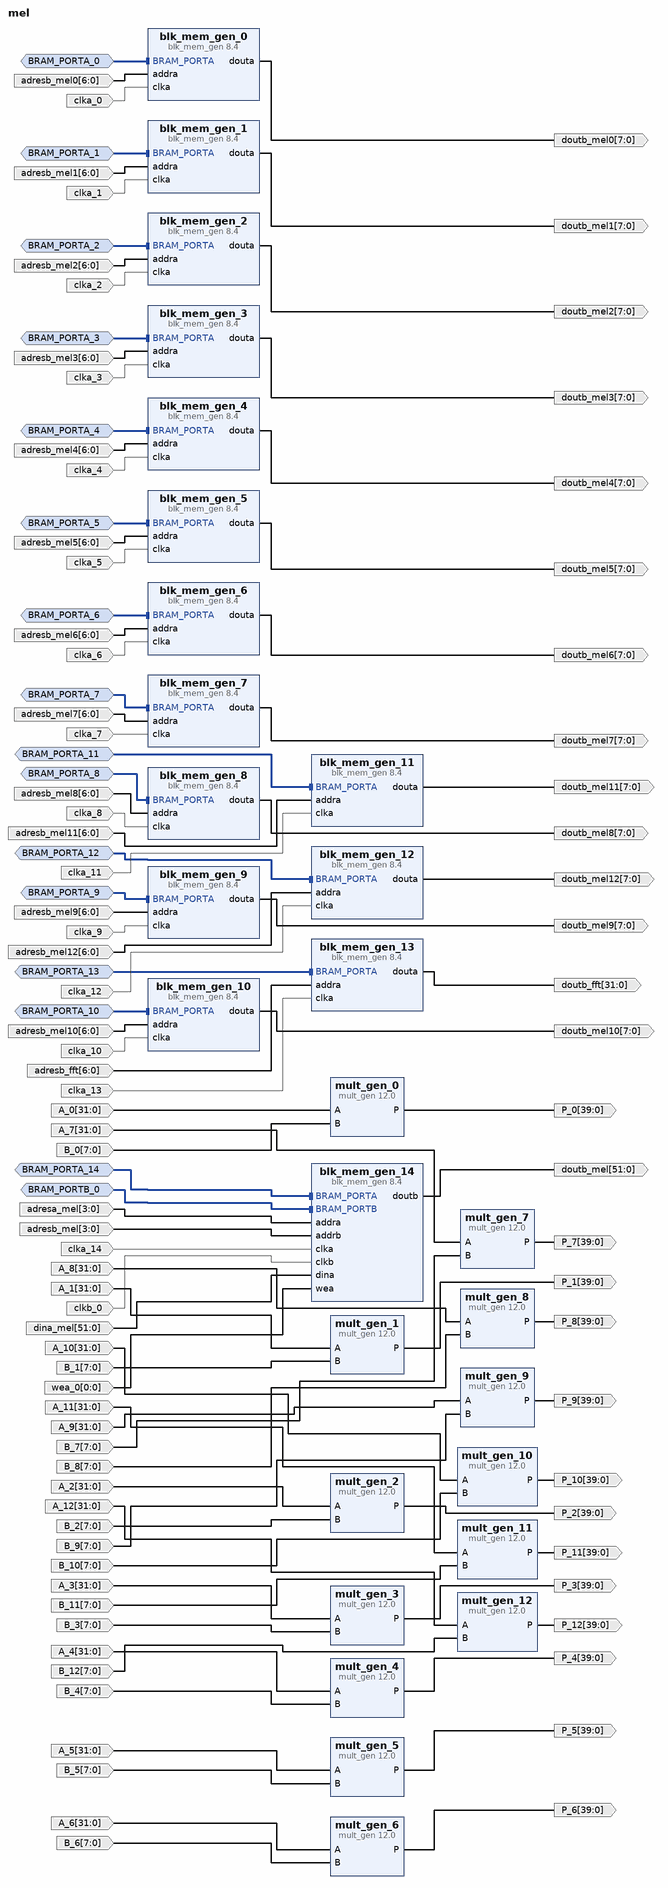
[diagram p0: block diagram of the top level]
# Vivado block design mel, xc7a35tcpg236-1, Vivado 2022.1
create_bd_design mel

create_bd_intf_port -mode Slave -vlnv xilinx.com:interface:bram_rtl:1.0 BRAM_PORTA_0
create_bd_intf_port -mode Slave -vlnv xilinx.com:interface:bram_rtl:1.0 BRAM_PORTA_1
create_bd_intf_port -mode Slave -vlnv xilinx.com:interface:bram_rtl:1.0 BRAM_PORTA_2
create_bd_intf_port -mode Slave -vlnv xilinx.com:interface:bram_rtl:1.0 BRAM_PORTA_3
create_bd_intf_port -mode Slave -vlnv xilinx.com:interface:bram_rtl:1.0 BRAM_PORTA_4
create_bd_intf_port -mode Slave -vlnv xilinx.com:interface:bram_rtl:1.0 BRAM_PORTA_5
create_bd_intf_port -mode Slave -vlnv xilinx.com:interface:bram_rtl:1.0 BRAM_PORTA_6
create_bd_intf_port -mode Slave -vlnv xilinx.com:interface:bram_rtl:1.0 BRAM_PORTA_7
create_bd_intf_port -mode Slave -vlnv xilinx.com:interface:bram_rtl:1.0 BRAM_PORTA_8
create_bd_intf_port -mode Slave -vlnv xilinx.com:interface:bram_rtl:1.0 BRAM_PORTA_9
create_bd_intf_port -mode Slave -vlnv xilinx.com:interface:bram_rtl:1.0 BRAM_PORTA_10
create_bd_intf_port -mode Slave -vlnv xilinx.com:interface:bram_rtl:1.0 BRAM_PORTA_11
create_bd_intf_port -mode Slave -vlnv xilinx.com:interface:bram_rtl:1.0 BRAM_PORTA_12
create_bd_intf_port -mode Slave -vlnv xilinx.com:interface:bram_rtl:1.0 BRAM_PORTA_13
create_bd_intf_port -mode Slave -vlnv xilinx.com:interface:bram_rtl:1.0 BRAM_PORTA_14
create_bd_intf_port -mode Slave -vlnv xilinx.com:interface:bram_rtl:1.0 BRAM_PORTB_0
create_bd_port -dir I -from 31 -to 0 -type data A_0
create_bd_port -dir I -from 7 -to 0 -type data B_0
create_bd_port -dir O -from 39 -to 0 -type data P_0
create_bd_port -dir I -from 31 -to 0 -type data A_1
create_bd_port -dir I -from 7 -to 0 -type data B_1
create_bd_port -dir O -from 39 -to 0 -type data P_1
create_bd_port -dir I -from 31 -to 0 -type data A_2
create_bd_port -dir I -from 7 -to 0 -type data B_2
create_bd_port -dir O -from 39 -to 0 -type data P_2
create_bd_port -dir I -from 31 -to 0 -type data A_3
create_bd_port -dir I -from 7 -to 0 -type data B_3
create_bd_port -dir O -from 39 -to 0 -type data P_3
create_bd_port -dir I -from 31 -to 0 -type data A_4
create_bd_port -dir I -from 7 -to 0 -type data B_4
create_bd_port -dir O -from 39 -to 0 -type data P_4
create_bd_port -dir I -from 31 -to 0 -type data A_5
create_bd_port -dir I -from 7 -to 0 -type data B_5
create_bd_port -dir O -from 39 -to 0 -type data P_5
create_bd_port -dir I -from 31 -to 0 -type data A_6
create_bd_port -dir I -from 7 -to 0 -type data B_6
create_bd_port -dir O -from 39 -to 0 -type data P_6
create_bd_port -dir I -from 31 -to 0 -type data A_7
create_bd_port -dir I -from 7 -to 0 -type data B_7
create_bd_port -dir O -from 39 -to 0 -type data P_7
create_bd_port -dir I -from 31 -to 0 -type data A_8
create_bd_port -dir I -from 7 -to 0 -type data B_8
create_bd_port -dir O -from 39 -to 0 -type data P_8
create_bd_port -dir I -from 31 -to 0 -type data A_9
create_bd_port -dir I -from 7 -to 0 -type data B_9
create_bd_port -dir O -from 39 -to 0 -type data P_9
create_bd_port -dir I -from 31 -to 0 -type data A_10
create_bd_port -dir I -from 7 -to 0 -type data B_10
create_bd_port -dir O -from 39 -to 0 -type data P_10
create_bd_port -dir I -from 31 -to 0 -type data A_11
create_bd_port -dir I -from 7 -to 0 -type data B_11
create_bd_port -dir O -from 39 -to 0 -type data P_11
create_bd_port -dir I -from 31 -to 0 -type data A_12
create_bd_port -dir I -from 7 -to 0 -type data B_12
create_bd_port -dir O -from 39 -to 0 -type data P_12
create_bd_port -dir I -from 6 -to 0 adresb_mel0
create_bd_port -dir I -type clk clka_0
create_bd_port -dir O -from 7 -to 0 doutb_mel0
create_bd_port -dir I -from 6 -to 0 adresb_mel1
create_bd_port -dir I -type clk clka_1
create_bd_port -dir O -from 7 -to 0 doutb_mel1
create_bd_port -dir I -from 6 -to 0 adresb_mel2
create_bd_port -dir I -type clk clka_2
create_bd_port -dir O -from 7 -to 0 doutb_mel2
create_bd_port -dir I -from 6 -to 0 adresb_mel3
create_bd_port -dir I -type clk clka_3
create_bd_port -dir O -from 7 -to 0 doutb_mel3
create_bd_port -dir I -from 6 -to 0 adresb_mel4
create_bd_port -dir I -type clk clka_4
create_bd_port -dir O -from 7 -to 0 doutb_mel4
create_bd_port -dir I -from 6 -to 0 adresb_mel5
create_bd_port -dir I -type clk clka_5
create_bd_port -dir O -from 7 -to 0 doutb_mel5
create_bd_port -dir I -from 6 -to 0 adresb_mel6
create_bd_port -dir I -type clk clka_6
create_bd_port -dir O -from 7 -to 0 doutb_mel6
create_bd_port -dir I -from 6 -to 0 adresb_mel7
create_bd_port -dir I -type clk clka_7
create_bd_port -dir O -from 7 -to 0 doutb_mel7
create_bd_port -dir I -from 6 -to 0 adresb_mel8
create_bd_port -dir I -type clk clka_8
create_bd_port -dir O -from 7 -to 0 doutb_mel8
create_bd_port -dir I -from 6 -to 0 adresb_mel9
create_bd_port -dir I -type clk clka_9
create_bd_port -dir O -from 7 -to 0 doutb_mel9
create_bd_port -dir I -from 6 -to 0 adresb_mel10
create_bd_port -dir I -type clk clka_10
create_bd_port -dir O -from 7 -to 0 doutb_mel10
create_bd_port -dir I -from 6 -to 0 adresb_mel11
create_bd_port -dir I -type clk clka_11
create_bd_port -dir O -from 7 -to 0 doutb_mel11
create_bd_port -dir I -from 6 -to 0 adresb_mel12
create_bd_port -dir I -type clk clka_12
create_bd_port -dir O -from 7 -to 0 doutb_mel12
create_bd_port -dir I -from 6 -to 0 adresb_fft
create_bd_port -dir I -type clk clka_13
create_bd_port -dir O -from 31 -to 0 doutb_fft
create_bd_port -dir I -from 3 -to 0 adresa_mel
create_bd_port -dir I -type clk clka_14
create_bd_port -dir I -from 51 -to 0 dina_mel
create_bd_port -dir I -from 0 -to 0 wea_0
create_bd_port -dir I -from 3 -to 0 adresb_mel
create_bd_port -dir I -type clk clkb_0
create_bd_port -dir O -from 51 -to 0 doutb_mel

create_bd_cell -type ip -vlnv xilinx.com:ip:blk_mem_gen:8.4 blk_mem_gen_0
set_property -dict [list \
  CONFIG.Coe_File {../../../../../../../mel coeler/mel_1.coe} \
  CONFIG.Enable_32bit_Address false \
  CONFIG.Enable_A Always_Enabled \
  CONFIG.Load_Init_File true \
  CONFIG.Memory_Type Single_Port_ROM \
  CONFIG.Port_A_Write_Rate 0 \
  CONFIG.Register_PortA_Output_of_Memory_Primitives true \
  CONFIG.Use_RSTA_Pin false \
  CONFIG.Write_Depth_A 128 \
  CONFIG.Write_Width_A 8 \
  CONFIG.use_bram_block Stand_Alone \
] [get_bd_cells blk_mem_gen_0]
create_bd_cell -type ip -vlnv xilinx.com:ip:blk_mem_gen:8.4 blk_mem_gen_1
set_property -dict [list \
  CONFIG.Coe_File {../../../../../../../mel coeler/mel_2.coe} \
  CONFIG.Enable_32bit_Address false \
  CONFIG.Enable_A Always_Enabled \
  CONFIG.Load_Init_File true \
  CONFIG.Memory_Type Single_Port_ROM \
  CONFIG.Port_A_Write_Rate 0 \
  CONFIG.Register_PortA_Output_of_Memory_Primitives true \
  CONFIG.Use_RSTA_Pin false \
  CONFIG.Write_Depth_A 128 \
  CONFIG.Write_Width_A 8 \
  CONFIG.use_bram_block Stand_Alone \
] [get_bd_cells blk_mem_gen_1]
create_bd_cell -type ip -vlnv xilinx.com:ip:blk_mem_gen:8.4 blk_mem_gen_2
set_property -dict [list \
  CONFIG.Coe_File {../../../../../../../mel coeler/mel_3.coe} \
  CONFIG.Enable_32bit_Address false \
  CONFIG.Enable_A Always_Enabled \
  CONFIG.Load_Init_File true \
  CONFIG.Memory_Type Single_Port_ROM \
  CONFIG.Port_A_Write_Rate 0 \
  CONFIG.Register_PortA_Output_of_Memory_Primitives true \
  CONFIG.Use_RSTA_Pin false \
  CONFIG.Write_Depth_A 128 \
  CONFIG.Write_Width_A 8 \
  CONFIG.use_bram_block Stand_Alone \
] [get_bd_cells blk_mem_gen_2]
create_bd_cell -type ip -vlnv xilinx.com:ip:blk_mem_gen:8.4 blk_mem_gen_3
set_property -dict [list \
  CONFIG.Coe_File {../../../../../../../mel coeler/mel_4.coe} \
  CONFIG.Enable_32bit_Address false \
  CONFIG.Enable_A Always_Enabled \
  CONFIG.Load_Init_File true \
  CONFIG.Memory_Type Single_Port_ROM \
  CONFIG.Port_A_Write_Rate 0 \
  CONFIG.Register_PortA_Output_of_Memory_Primitives true \
  CONFIG.Use_RSTA_Pin false \
  CONFIG.Write_Depth_A 128 \
  CONFIG.Write_Width_A 8 \
  CONFIG.use_bram_block Stand_Alone \
] [get_bd_cells blk_mem_gen_3]
create_bd_cell -type ip -vlnv xilinx.com:ip:blk_mem_gen:8.4 blk_mem_gen_4
set_property -dict [list \
  CONFIG.Coe_File {../../../../../../../mel coeler/mel_5.coe} \
  CONFIG.Enable_32bit_Address false \
  CONFIG.Enable_A Always_Enabled \
  CONFIG.Load_Init_File true \
  CONFIG.Memory_Type Single_Port_ROM \
  CONFIG.Port_A_Write_Rate 0 \
  CONFIG.Register_PortA_Output_of_Memory_Primitives true \
  CONFIG.Use_RSTA_Pin false \
  CONFIG.Write_Depth_A 128 \
  CONFIG.Write_Width_A 8 \
  CONFIG.use_bram_block Stand_Alone \
] [get_bd_cells blk_mem_gen_4]
create_bd_cell -type ip -vlnv xilinx.com:ip:blk_mem_gen:8.4 blk_mem_gen_5
set_property -dict [list \
  CONFIG.Coe_File {../../../../../../../mel coeler/mel_6.coe} \
  CONFIG.Enable_32bit_Address false \
  CONFIG.Enable_A Always_Enabled \
  CONFIG.Load_Init_File true \
  CONFIG.Memory_Type Single_Port_ROM \
  CONFIG.Port_A_Write_Rate 0 \
  CONFIG.Register_PortA_Output_of_Memory_Primitives true \
  CONFIG.Use_RSTA_Pin false \
  CONFIG.Write_Depth_A 128 \
  CONFIG.Write_Width_A 8 \
  CONFIG.use_bram_block Stand_Alone \
] [get_bd_cells blk_mem_gen_5]
create_bd_cell -type ip -vlnv xilinx.com:ip:blk_mem_gen:8.4 blk_mem_gen_6
set_property -dict [list \
  CONFIG.Coe_File {../../../../../../../mel coeler/mel_7.coe} \
  CONFIG.Enable_32bit_Address false \
  CONFIG.Enable_A Always_Enabled \
  CONFIG.Load_Init_File true \
  CONFIG.Memory_Type Single_Port_ROM \
  CONFIG.Port_A_Write_Rate 0 \
  CONFIG.Register_PortA_Output_of_Memory_Primitives true \
  CONFIG.Use_RSTA_Pin false \
  CONFIG.Write_Depth_A 128 \
  CONFIG.Write_Width_A 8 \
  CONFIG.use_bram_block Stand_Alone \
] [get_bd_cells blk_mem_gen_6]
create_bd_cell -type ip -vlnv xilinx.com:ip:blk_mem_gen:8.4 blk_mem_gen_7
set_property -dict [list \
  CONFIG.Coe_File {../../../../../../../mel coeler/mel_8.coe} \
  CONFIG.Enable_32bit_Address false \
  CONFIG.Enable_A Always_Enabled \
  CONFIG.Load_Init_File true \
  CONFIG.Memory_Type Single_Port_ROM \
  CONFIG.Port_A_Write_Rate 0 \
  CONFIG.Register_PortA_Output_of_Memory_Primitives true \
  CONFIG.Use_RSTA_Pin false \
  CONFIG.Write_Depth_A 128 \
  CONFIG.Write_Width_A 8 \
  CONFIG.use_bram_block Stand_Alone \
] [get_bd_cells blk_mem_gen_7]
create_bd_cell -type ip -vlnv xilinx.com:ip:blk_mem_gen:8.4 blk_mem_gen_8
set_property -dict [list \
  CONFIG.Coe_File {../../../../../../../mel coeler/mel_9.coe} \
  CONFIG.Enable_32bit_Address false \
  CONFIG.Enable_A Always_Enabled \
  CONFIG.Load_Init_File true \
  CONFIG.Memory_Type Single_Port_ROM \
  CONFIG.Port_A_Write_Rate 0 \
  CONFIG.Register_PortA_Output_of_Memory_Primitives true \
  CONFIG.Use_RSTA_Pin false \
  CONFIG.Write_Depth_A 128 \
  CONFIG.Write_Width_A 8 \
  CONFIG.use_bram_block Stand_Alone \
] [get_bd_cells blk_mem_gen_8]
create_bd_cell -type ip -vlnv xilinx.com:ip:blk_mem_gen:8.4 blk_mem_gen_9
set_property -dict [list \
  CONFIG.Coe_File {../../../../../../../mel coeler/mel_10.coe} \
  CONFIG.Enable_32bit_Address false \
  CONFIG.Enable_A Always_Enabled \
  CONFIG.Load_Init_File true \
  CONFIG.Memory_Type Single_Port_ROM \
  CONFIG.Port_A_Write_Rate 0 \
  CONFIG.Register_PortA_Output_of_Memory_Primitives true \
  CONFIG.Use_RSTA_Pin false \
  CONFIG.Write_Depth_A 128 \
  CONFIG.Write_Width_A 8 \
  CONFIG.use_bram_block Stand_Alone \
] [get_bd_cells blk_mem_gen_9]
create_bd_cell -type ip -vlnv xilinx.com:ip:blk_mem_gen:8.4 blk_mem_gen_10
set_property -dict [list \
  CONFIG.Coe_File {../../../../../../../mel coeler/mel_11.coe} \
  CONFIG.Enable_32bit_Address false \
  CONFIG.Enable_A Always_Enabled \
  CONFIG.Load_Init_File true \
  CONFIG.Memory_Type Single_Port_ROM \
  CONFIG.Port_A_Write_Rate 0 \
  CONFIG.Register_PortA_Output_of_Memory_Primitives true \
  CONFIG.Use_RSTA_Pin false \
  CONFIG.Write_Depth_A 128 \
  CONFIG.Write_Width_A 8 \
  CONFIG.use_bram_block Stand_Alone \
] [get_bd_cells blk_mem_gen_10]
create_bd_cell -type ip -vlnv xilinx.com:ip:blk_mem_gen:8.4 blk_mem_gen_11
set_property -dict [list \
  CONFIG.Coe_File {../../../../../../../mel coeler/mel_12.coe} \
  CONFIG.Enable_32bit_Address false \
  CONFIG.Enable_A Always_Enabled \
  CONFIG.Load_Init_File true \
  CONFIG.Memory_Type Single_Port_ROM \
  CONFIG.Port_A_Write_Rate 0 \
  CONFIG.Register_PortA_Output_of_Memory_Primitives true \
  CONFIG.Use_RSTA_Pin false \
  CONFIG.Write_Depth_A 128 \
  CONFIG.Write_Width_A 8 \
  CONFIG.use_bram_block Stand_Alone \
] [get_bd_cells blk_mem_gen_11]
create_bd_cell -type ip -vlnv xilinx.com:ip:blk_mem_gen:8.4 blk_mem_gen_12
set_property -dict [list \
  CONFIG.Coe_File {../../../../../../../mel coeler/mel_13.coe} \
  CONFIG.Enable_32bit_Address false \
  CONFIG.Enable_A Always_Enabled \
  CONFIG.Load_Init_File true \
  CONFIG.Memory_Type Single_Port_ROM \
  CONFIG.Port_A_Write_Rate 0 \
  CONFIG.Register_PortA_Output_of_Memory_Primitives true \
  CONFIG.Use_RSTA_Pin false \
  CONFIG.Write_Depth_A 128 \
  CONFIG.Write_Width_A 8 \
  CONFIG.use_bram_block Stand_Alone \
] [get_bd_cells blk_mem_gen_12]
create_bd_cell -type ip -vlnv xilinx.com:ip:blk_mem_gen:8.4 blk_mem_gen_13
set_property -dict [list \
  CONFIG.Coe_File {../../../../../../../mel coeler/arda_coe.coe} \
  CONFIG.Enable_32bit_Address false \
  CONFIG.Enable_A Always_Enabled \
  CONFIG.Load_Init_File true \
  CONFIG.Memory_Type Single_Port_ROM \
  CONFIG.Port_A_Write_Rate 0 \
  CONFIG.Register_PortA_Output_of_Memory_Primitives true \
  CONFIG.Use_RSTA_Pin false \
  CONFIG.Write_Depth_A 128 \
  CONFIG.use_bram_block Stand_Alone \
] [get_bd_cells blk_mem_gen_13]
create_bd_cell -type ip -vlnv xilinx.com:ip:blk_mem_gen:8.4 blk_mem_gen_14
set_property -dict [list \
  CONFIG.Enable_32bit_Address false \
  CONFIG.Enable_A Always_Enabled \
  CONFIG.Enable_B Always_Enabled \
  CONFIG.Memory_Type Simple_Dual_Port_RAM \
  CONFIG.Operating_Mode_A NO_CHANGE \
  CONFIG.Port_B_Clock 100 \
  CONFIG.Port_B_Enable_Rate 100 \
  CONFIG.Read_Width_B 52 \
  CONFIG.Register_PortB_Output_of_Memory_Primitives true \
  CONFIG.Use_Byte_Write_Enable false \
  CONFIG.Write_Depth_A 13 \
  CONFIG.Write_Width_A 52 \
  CONFIG.Write_Width_B 52 \
  CONFIG.use_bram_block Stand_Alone \
] [get_bd_cells blk_mem_gen_14]
create_bd_cell -type ip -vlnv xilinx.com:ip:mult_gen:12.0 mult_gen_0
set_property -dict [list \
  CONFIG.Multiplier_Construction Use_Mults \
  CONFIG.PipeStages 0 \
  CONFIG.PortAType Unsigned \
  CONFIG.PortAWidth 32 \
  CONFIG.PortBType Unsigned \
  CONFIG.PortBWidth 8 \
] [get_bd_cells mult_gen_0]
create_bd_cell -type ip -vlnv xilinx.com:ip:mult_gen:12.0 mult_gen_1
set_property -dict [list \
  CONFIG.Multiplier_Construction Use_Mults \
  CONFIG.PipeStages 0 \
  CONFIG.PortAType Unsigned \
  CONFIG.PortAWidth 32 \
  CONFIG.PortBType Unsigned \
  CONFIG.PortBWidth 8 \
] [get_bd_cells mult_gen_1]
create_bd_cell -type ip -vlnv xilinx.com:ip:mult_gen:12.0 mult_gen_2
set_property -dict [list \
  CONFIG.Multiplier_Construction Use_Mults \
  CONFIG.PipeStages 0 \
  CONFIG.PortAType Unsigned \
  CONFIG.PortAWidth 32 \
  CONFIG.PortBType Unsigned \
  CONFIG.PortBWidth 8 \
] [get_bd_cells mult_gen_2]
create_bd_cell -type ip -vlnv xilinx.com:ip:mult_gen:12.0 mult_gen_3
set_property -dict [list \
  CONFIG.Multiplier_Construction Use_Mults \
  CONFIG.PipeStages 0 \
  CONFIG.PortAType Unsigned \
  CONFIG.PortAWidth 32 \
  CONFIG.PortBType Unsigned \
  CONFIG.PortBWidth 8 \
] [get_bd_cells mult_gen_3]
create_bd_cell -type ip -vlnv xilinx.com:ip:mult_gen:12.0 mult_gen_4
set_property -dict [list \
  CONFIG.Multiplier_Construction Use_Mults \
  CONFIG.PipeStages 0 \
  CONFIG.PortAType Unsigned \
  CONFIG.PortAWidth 32 \
  CONFIG.PortBType Unsigned \
  CONFIG.PortBWidth 8 \
] [get_bd_cells mult_gen_4]
create_bd_cell -type ip -vlnv xilinx.com:ip:mult_gen:12.0 mult_gen_5
set_property -dict [list \
  CONFIG.Multiplier_Construction Use_Mults \
  CONFIG.PipeStages 0 \
  CONFIG.PortAType Unsigned \
  CONFIG.PortAWidth 32 \
  CONFIG.PortBType Unsigned \
  CONFIG.PortBWidth 8 \
] [get_bd_cells mult_gen_5]
create_bd_cell -type ip -vlnv xilinx.com:ip:mult_gen:12.0 mult_gen_6
set_property -dict [list \
  CONFIG.Multiplier_Construction Use_Mults \
  CONFIG.PipeStages 0 \
  CONFIG.PortAType Unsigned \
  CONFIG.PortAWidth 32 \
  CONFIG.PortBType Unsigned \
  CONFIG.PortBWidth 8 \
] [get_bd_cells mult_gen_6]
create_bd_cell -type ip -vlnv xilinx.com:ip:mult_gen:12.0 mult_gen_7
set_property -dict [list \
  CONFIG.Multiplier_Construction Use_Mults \
  CONFIG.PipeStages 0 \
  CONFIG.PortAType Unsigned \
  CONFIG.PortAWidth 32 \
  CONFIG.PortBType Unsigned \
  CONFIG.PortBWidth 8 \
] [get_bd_cells mult_gen_7]
create_bd_cell -type ip -vlnv xilinx.com:ip:mult_gen:12.0 mult_gen_8
set_property -dict [list \
  CONFIG.Multiplier_Construction Use_Mults \
  CONFIG.PipeStages 0 \
  CONFIG.PortAType Unsigned \
  CONFIG.PortAWidth 32 \
  CONFIG.PortBType Unsigned \
  CONFIG.PortBWidth 8 \
] [get_bd_cells mult_gen_8]
create_bd_cell -type ip -vlnv xilinx.com:ip:mult_gen:12.0 mult_gen_9
set_property -dict [list \
  CONFIG.Multiplier_Construction Use_Mults \
  CONFIG.PipeStages 0 \
  CONFIG.PortAType Unsigned \
  CONFIG.PortAWidth 32 \
  CONFIG.PortBType Unsigned \
  CONFIG.PortBWidth 8 \
] [get_bd_cells mult_gen_9]
create_bd_cell -type ip -vlnv xilinx.com:ip:mult_gen:12.0 mult_gen_10
set_property -dict [list \
  CONFIG.Multiplier_Construction Use_Mults \
  CONFIG.PipeStages 0 \
  CONFIG.PortAType Unsigned \
  CONFIG.PortAWidth 32 \
  CONFIG.PortBType Unsigned \
  CONFIG.PortBWidth 8 \
] [get_bd_cells mult_gen_10]
create_bd_cell -type ip -vlnv xilinx.com:ip:mult_gen:12.0 mult_gen_11
set_property -dict [list \
  CONFIG.Multiplier_Construction Use_Mults \
  CONFIG.PipeStages 0 \
  CONFIG.PortAType Unsigned \
  CONFIG.PortAWidth 32 \
  CONFIG.PortBType Unsigned \
  CONFIG.PortBWidth 8 \
] [get_bd_cells mult_gen_11]
create_bd_cell -type ip -vlnv xilinx.com:ip:mult_gen:12.0 mult_gen_12
set_property -dict [list \
  CONFIG.Multiplier_Construction Use_Mults \
  CONFIG.PipeStages 0 \
  CONFIG.PortAType Unsigned \
  CONFIG.PortAWidth 32 \
  CONFIG.PortBType Unsigned \
  CONFIG.PortBWidth 8 \
] [get_bd_cells mult_gen_12]

# ---- connections ----

connect_bd_intf_net -intf_net BRAM_PORTA_0_1 [get_bd_intf_ports BRAM_PORTA_0] [get_bd_intf_pins blk_mem_gen_0/BRAM_PORTA]
connect_bd_intf_net -intf_net BRAM_PORTA_10_1 [get_bd_intf_ports BRAM_PORTA_10] [get_bd_intf_pins blk_mem_gen_10/BRAM_PORTA]
connect_bd_intf_net -intf_net BRAM_PORTA_11_1 [get_bd_intf_ports BRAM_PORTA_11] [get_bd_intf_pins blk_mem_gen_11/BRAM_PORTA]
connect_bd_intf_net -intf_net BRAM_PORTA_12_1 [get_bd_intf_ports BRAM_PORTA_12] [get_bd_intf_pins blk_mem_gen_12/BRAM_PORTA]
connect_bd_intf_net -intf_net BRAM_PORTA_13_1 [get_bd_intf_ports BRAM_PORTA_13] [get_bd_intf_pins blk_mem_gen_13/BRAM_PORTA]
connect_bd_intf_net -intf_net BRAM_PORTA_14_1 [get_bd_intf_ports BRAM_PORTA_14] [get_bd_intf_pins blk_mem_gen_14/BRAM_PORTA]
connect_bd_intf_net -intf_net BRAM_PORTA_1_1 [get_bd_intf_ports BRAM_PORTA_1] [get_bd_intf_pins blk_mem_gen_1/BRAM_PORTA]
connect_bd_intf_net -intf_net BRAM_PORTA_2_1 [get_bd_intf_ports BRAM_PORTA_2] [get_bd_intf_pins blk_mem_gen_2/BRAM_PORTA]
connect_bd_intf_net -intf_net BRAM_PORTA_3_1 [get_bd_intf_ports BRAM_PORTA_3] [get_bd_intf_pins blk_mem_gen_3/BRAM_PORTA]
connect_bd_intf_net -intf_net BRAM_PORTA_4_1 [get_bd_intf_ports BRAM_PORTA_4] [get_bd_intf_pins blk_mem_gen_4/BRAM_PORTA]
connect_bd_intf_net -intf_net BRAM_PORTA_5_1 [get_bd_intf_ports BRAM_PORTA_5] [get_bd_intf_pins blk_mem_gen_5/BRAM_PORTA]
connect_bd_intf_net -intf_net BRAM_PORTA_6_1 [get_bd_intf_ports BRAM_PORTA_6] [get_bd_intf_pins blk_mem_gen_6/BRAM_PORTA]
connect_bd_intf_net -intf_net BRAM_PORTA_7_1 [get_bd_intf_ports BRAM_PORTA_7] [get_bd_intf_pins blk_mem_gen_7/BRAM_PORTA]
connect_bd_intf_net -intf_net BRAM_PORTA_8_1 [get_bd_intf_ports BRAM_PORTA_8] [get_bd_intf_pins blk_mem_gen_8/BRAM_PORTA]
connect_bd_intf_net -intf_net BRAM_PORTA_9_1 [get_bd_intf_ports BRAM_PORTA_9] [get_bd_intf_pins blk_mem_gen_9/BRAM_PORTA]
connect_bd_intf_net -intf_net BRAM_PORTB_0_1 [get_bd_intf_ports BRAM_PORTB_0] [get_bd_intf_pins blk_mem_gen_14/BRAM_PORTB]
connect_bd_net -net A_0_1 [get_bd_ports A_0] [get_bd_pins mult_gen_0/A]
connect_bd_net -net A_10_1 [get_bd_ports A_10] [get_bd_pins mult_gen_10/A]
connect_bd_net -net A_11_1 [get_bd_ports A_11] [get_bd_pins mult_gen_11/A]
connect_bd_net -net A_12_1 [get_bd_ports A_12] [get_bd_pins mult_gen_12/A]
connect_bd_net -net A_1_1 [get_bd_ports A_1] [get_bd_pins mult_gen_1/A]
connect_bd_net -net A_2_1 [get_bd_ports A_2] [get_bd_pins mult_gen_2/A]
connect_bd_net -net A_3_1 [get_bd_ports A_3] [get_bd_pins mult_gen_3/A]
connect_bd_net -net A_4_1 [get_bd_ports A_4] [get_bd_pins mult_gen_4/A]
connect_bd_net -net A_5_1 [get_bd_ports A_5] [get_bd_pins mult_gen_5/A]
connect_bd_net -net A_6_1 [get_bd_ports A_6] [get_bd_pins mult_gen_6/A]
connect_bd_net -net A_7_1 [get_bd_ports A_7] [get_bd_pins mult_gen_7/A]
connect_bd_net -net A_8_1 [get_bd_ports A_8] [get_bd_pins mult_gen_8/A]
connect_bd_net -net A_9_1 [get_bd_ports A_9] [get_bd_pins mult_gen_9/A]
connect_bd_net -net B_0_1 [get_bd_ports B_0] [get_bd_pins mult_gen_0/B]
connect_bd_net -net B_10_1 [get_bd_ports B_10] [get_bd_pins mult_gen_10/B]
connect_bd_net -net B_11_1 [get_bd_ports B_11] [get_bd_pins mult_gen_11/B]
connect_bd_net -net B_12_1 [get_bd_ports B_12] [get_bd_pins mult_gen_12/B]
connect_bd_net -net B_1_1 [get_bd_ports B_1] [get_bd_pins mult_gen_1/B]
connect_bd_net -net B_2_1 [get_bd_ports B_2] [get_bd_pins mult_gen_2/B]
connect_bd_net -net B_3_1 [get_bd_ports B_3] [get_bd_pins mult_gen_3/B]
connect_bd_net -net B_4_1 [get_bd_ports B_4] [get_bd_pins mult_gen_4/B]
connect_bd_net -net B_5_1 [get_bd_ports B_5] [get_bd_pins mult_gen_5/B]
connect_bd_net -net B_6_1 [get_bd_ports B_6] [get_bd_pins mult_gen_6/B]
connect_bd_net -net B_7_1 [get_bd_ports B_7] [get_bd_pins mult_gen_7/B]
connect_bd_net -net B_8_1 [get_bd_ports B_8] [get_bd_pins mult_gen_8/B]
connect_bd_net -net B_9_1 [get_bd_ports B_9] [get_bd_pins mult_gen_9/B]
connect_bd_net -net addra_0_1 [get_bd_ports adresb_mel0] [get_bd_pins blk_mem_gen_0/addra]
connect_bd_net -net addra_10_1 [get_bd_ports adresb_mel10] [get_bd_pins blk_mem_gen_10/addra]
connect_bd_net -net addra_11_1 [get_bd_ports adresb_mel11] [get_bd_pins blk_mem_gen_11/addra]
connect_bd_net -net addra_12_1 [get_bd_ports adresb_mel12] [get_bd_pins blk_mem_gen_12/addra]
connect_bd_net -net addra_13_1 [get_bd_ports adresb_fft] [get_bd_pins blk_mem_gen_13/addra]
connect_bd_net -net addra_14_1 [get_bd_ports adresa_mel] [get_bd_pins blk_mem_gen_14/addra]
connect_bd_net -net addra_1_1 [get_bd_ports adresb_mel1] [get_bd_pins blk_mem_gen_1/addra]
connect_bd_net -net addra_2_1 [get_bd_ports adresb_mel2] [get_bd_pins blk_mem_gen_2/addra]
connect_bd_net -net addra_3_1 [get_bd_ports adresb_mel3] [get_bd_pins blk_mem_gen_3/addra]
connect_bd_net -net addra_4_1 [get_bd_ports adresb_mel4] [get_bd_pins blk_mem_gen_4/addra]
connect_bd_net -net addra_5_1 [get_bd_ports adresb_mel5] [get_bd_pins blk_mem_gen_5/addra]
connect_bd_net -net addra_6_1 [get_bd_ports adresb_mel6] [get_bd_pins blk_mem_gen_6/addra]
connect_bd_net -net addra_7_1 [get_bd_ports adresb_mel7] [get_bd_pins blk_mem_gen_7/addra]
connect_bd_net -net addra_8_1 [get_bd_ports adresb_mel8] [get_bd_pins blk_mem_gen_8/addra]
connect_bd_net -net addra_9_1 [get_bd_ports adresb_mel9] [get_bd_pins blk_mem_gen_9/addra]
connect_bd_net -net addrb_0_1 [get_bd_ports adresb_mel] [get_bd_pins blk_mem_gen_14/addrb]
connect_bd_net [get_bd_pins blk_mem_gen_0/douta] [get_bd_ports doutb_mel0]
connect_bd_net [get_bd_pins blk_mem_gen_10/douta] [get_bd_ports doutb_mel10]
connect_bd_net [get_bd_pins blk_mem_gen_11/douta] [get_bd_ports doutb_mel11]
connect_bd_net [get_bd_pins blk_mem_gen_12/douta] [get_bd_ports doutb_mel12]
connect_bd_net [get_bd_pins blk_mem_gen_13/douta] [get_bd_ports doutb_fft]
connect_bd_net [get_bd_pins blk_mem_gen_14/doutb] [get_bd_ports doutb_mel]
connect_bd_net [get_bd_pins blk_mem_gen_1/douta] [get_bd_ports doutb_mel1]
connect_bd_net [get_bd_pins blk_mem_gen_2/douta] [get_bd_ports doutb_mel2]
connect_bd_net [get_bd_pins blk_mem_gen_3/douta] [get_bd_ports doutb_mel3]
connect_bd_net [get_bd_pins blk_mem_gen_4/douta] [get_bd_ports doutb_mel4]
connect_bd_net [get_bd_pins blk_mem_gen_5/douta] [get_bd_ports doutb_mel5]
connect_bd_net [get_bd_pins blk_mem_gen_6/douta] [get_bd_ports doutb_mel6]
connect_bd_net [get_bd_pins blk_mem_gen_7/douta] [get_bd_ports doutb_mel7]
connect_bd_net [get_bd_pins blk_mem_gen_8/douta] [get_bd_ports doutb_mel8]
connect_bd_net [get_bd_pins blk_mem_gen_9/douta] [get_bd_ports doutb_mel9]
connect_bd_net -net clka_0_1 [get_bd_ports clka_0] [get_bd_pins blk_mem_gen_0/clka]
connect_bd_net -net clka_10_1 [get_bd_ports clka_10] [get_bd_pins blk_mem_gen_10/clka]
connect_bd_net -net clka_11_1 [get_bd_ports clka_11] [get_bd_pins blk_mem_gen_11/clka]
connect_bd_net -net clka_12_1 [get_bd_ports clka_12] [get_bd_pins blk_mem_gen_12/clka]
connect_bd_net -net clka_13_1 [get_bd_ports clka_13] [get_bd_pins blk_mem_gen_13/clka]
connect_bd_net -net clka_14_1 [get_bd_ports clka_14] [get_bd_pins blk_mem_gen_14/clka]
connect_bd_net -net clka_1_1 [get_bd_ports clka_1] [get_bd_pins blk_mem_gen_1/clka]
connect_bd_net -net clka_2_1 [get_bd_ports clka_2] [get_bd_pins blk_mem_gen_2/clka]
connect_bd_net -net clka_3_1 [get_bd_ports clka_3] [get_bd_pins blk_mem_gen_3/clka]
connect_bd_net -net clka_4_1 [get_bd_ports clka_4] [get_bd_pins blk_mem_gen_4/clka]
connect_bd_net -net clka_5_1 [get_bd_ports clka_5] [get_bd_pins blk_mem_gen_5/clka]
connect_bd_net -net clka_6_1 [get_bd_ports clka_6] [get_bd_pins blk_mem_gen_6/clka]
connect_bd_net -net clka_7_1 [get_bd_ports clka_7] [get_bd_pins blk_mem_gen_7/clka]
connect_bd_net -net clka_8_1 [get_bd_ports clka_8] [get_bd_pins blk_mem_gen_8/clka]
connect_bd_net -net clka_9_1 [get_bd_ports clka_9] [get_bd_pins blk_mem_gen_9/clka]
connect_bd_net -net clkb_0_1 [get_bd_ports clkb_0] [get_bd_pins blk_mem_gen_14/clkb]
connect_bd_net -net dina_0_1 [get_bd_ports dina_mel] [get_bd_pins blk_mem_gen_14/dina]
connect_bd_net [get_bd_pins mult_gen_0/P] [get_bd_ports P_0]
connect_bd_net [get_bd_pins mult_gen_10/P] [get_bd_ports P_10]
connect_bd_net [get_bd_pins mult_gen_11/P] [get_bd_ports P_11]
connect_bd_net [get_bd_pins mult_gen_12/P] [get_bd_ports P_12]
connect_bd_net [get_bd_pins mult_gen_1/P] [get_bd_ports P_1]
connect_bd_net [get_bd_pins mult_gen_2/P] [get_bd_ports P_2]
connect_bd_net [get_bd_pins mult_gen_3/P] [get_bd_ports P_3]
connect_bd_net [get_bd_pins mult_gen_4/P] [get_bd_ports P_4]
connect_bd_net [get_bd_pins mult_gen_5/P] [get_bd_ports P_5]
connect_bd_net [get_bd_pins mult_gen_6/P] [get_bd_ports P_6]
connect_bd_net [get_bd_pins mult_gen_7/P] [get_bd_ports P_7]
connect_bd_net [get_bd_pins mult_gen_8/P] [get_bd_ports P_8]
connect_bd_net [get_bd_pins mult_gen_9/P] [get_bd_ports P_9]
connect_bd_net -net wea_0_1 [get_bd_ports wea_0] [get_bd_pins blk_mem_gen_14/wea]

validate_bd_design
save_bd_design
